# EAGLE design unipolar stepp connect (EAGLE 7.6.0)
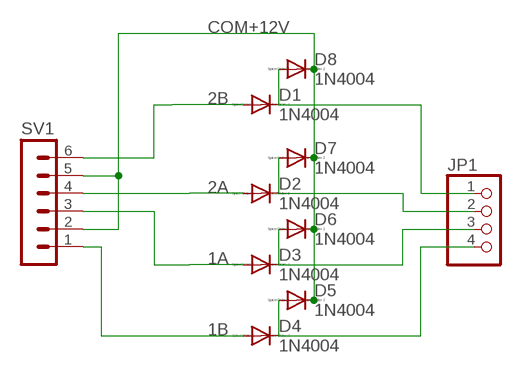
[diagram p0: schematic, sheet 1]

## Parts
D1  1N4004  [DO41-10]
D2  1N4004  [DO41-10]
D3  1N4004  [DO41-10]
D4  1N4004  [DO41-10]
D5  1N4004  [DO41-10]
D6  1N4004  [DO41-10]
D7  1N4004  [DO41-10]
D8  1N4004  [DO41-10]
JP1  PINHD-1X4/90  [1X04/90]
SV1  MA06-1  [MA06-1]

## Nets
1A: D3.A SV1.3
1B: D4.A SV1.1
2A: D2.A SV1.4
2B: D1.A SV1.6
COM+12V: D5.C D6.C D7.C D8.C SV1.2 SV1.5
N$1: D1.C D8.A JP1.1
N$2: D2.C D7.A JP1.2
N$3: D3.C D6.A JP1.3
N$4: D4.C D5.A JP1.4

## Library data of the parts
D1-D8 = diode:1N4004: DIODE general purpose rectifier, 1 A
JP1 = pinhead:PINHD-1X4: PIN HEADER
SV1 = con-lstb:MA06-1: PIN HEADER; OC_FARNELL: unknown; OC_NEWARK: unknown

## Board
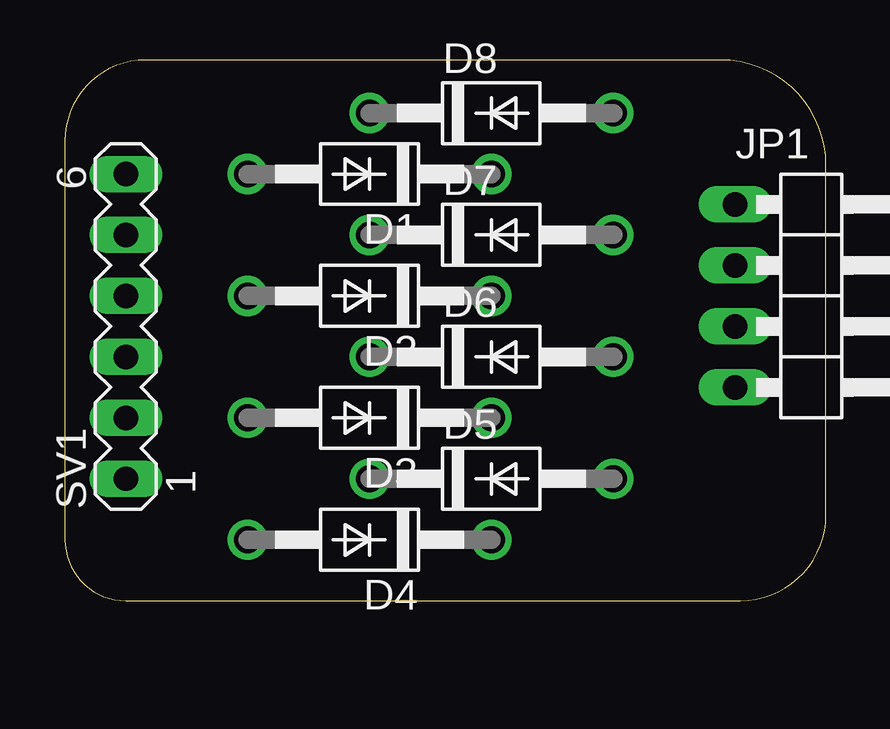
[diagram p1: board, top side]
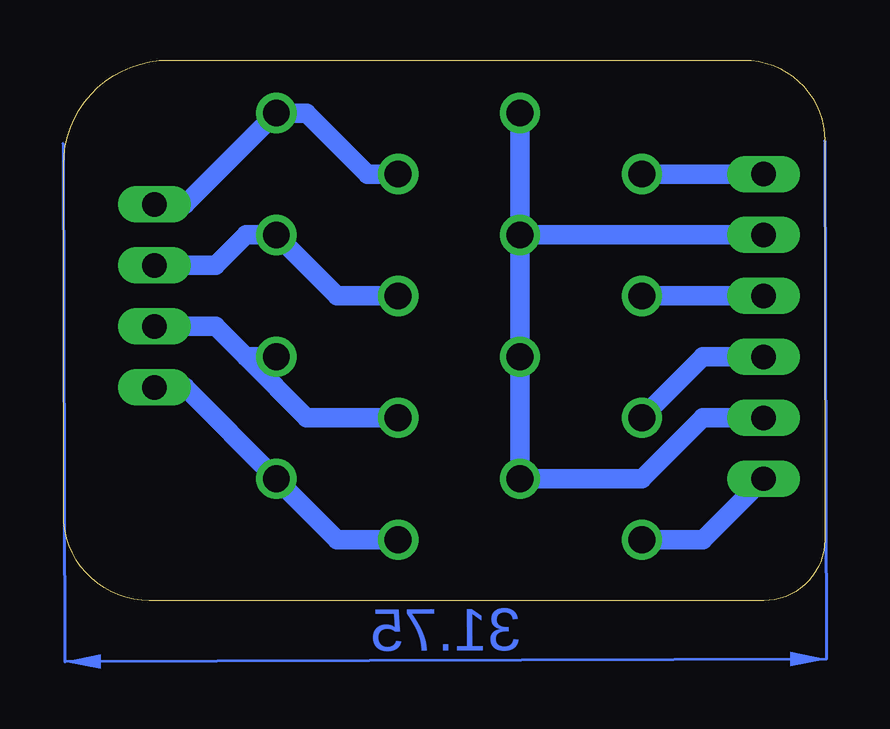
[diagram p2: board, bottom side, seen from below]

Size 31.73 x 22.53 mm. Coordinates in mm from the lower left corner, seen from the top.
Outline: 0,19.16 0,2.54 arc90 2.54,0 28.15,0 arc90 31.73,3.58 31.73,18.14 arc90 27.34,22.53 3.37,22.53 arc90 0,19.16
Copper layers (1*16): Top 0.035mm / dielectric 1.5mm / Bottom 0.035mm
Design rules "default": minimum track width 10mil, minimum drill 24mil, track to track 8mil, track to pad 8mil, pad to pad 8mil, via to via 8mil, smd to smd 8mil, copper to edge 40mil, drill to drill 8mil, minimum pad ring 10mil, minimum via ring 8mil, stop-mask expansion 4mil, vias tented up to drill 0mil, thermal gap 10mil

### Footprints (pad centres in the part's own frame; a part is rotated, then mirrored left to right if it is on the bottom)
DO41-10 = drill 1.118: A 5.08,0; C -5.08,0
1X04/90 = drill 1.016 long: 1 -3.81,-3.81; 2 -1.27,-3.81; 3 1.27,-3.81; 4 3.81,-3.81
MA06-1 = drill 1.016 long: 1 -6.35,0; 2 -3.81,0; 3 -1.27,0; 4 1.27,0; 5 3.81,0; 6 6.35,0

### Placement (x,y rotation side)
D1  12.7,17.78 180 top
D2  12.7,12.7 180 top
D3  12.7,7.62 180 top
D4  12.7,2.54 180 top
D5  17.78,5.08 0 top
D6  17.78,10.16 0 top
D7  17.78,15.24 0 top
D8  17.78,20.32 0 top
JP1  31.75,12.7 270 top
SV1  2.54,11.43 90 top

### Tracks (layer width: path | path; a pad name or v marks a point on that pad's centre or on a via)
1A
  Bottom 0.813: SV1.3 5.08,10.16 D3.A
1B
  Bottom 0.813: SV1.1 5.08,2.54 D4.A
2A
  Bottom 0.813: SV1.4 D2.A
2B
  Bottom 0.813: SV1.6 D1.A
COM+12V
  Bottom 0.813: D8.C D7.C | D7.C D6.C D5.C | D7.C D5.C | SV1.2 5.08,7.62 7.62,5.08 D5.C | SV1.5 D7.C
N$1
  Bottom 0.813: JP1.1 26.67,16.51 D8.A 21.59,20.32 19.05,17.78 D1.C
N$2
  Bottom 0.813: JP1.2 25.4,13.97 24.13,15.24 D7.A 20.32,12.7 D2.C
N$3
  Bottom 0.813: D6.A 24.13,10.16 | 24.13,10.16 25.4,11.43 JP1.3 | D3.C 21.59,7.62 24.13,10.16
N$4
  Bottom 0.813: JP1.4 26.67,8.89 D5.A 20.32,2.54 D4.C
(copper drawn outside any net)
  shapes: Bottom area x1